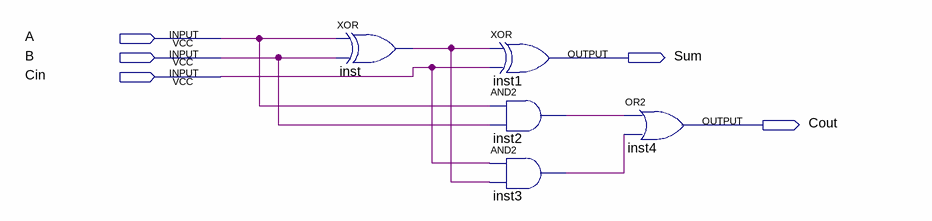
[diagram p0: schematic sheet]
// Quartus schematic FullAdder.bdf as structural Verilog: 5 symbols, 5 pins
module FullAdder (
  input  A,
  input  B,
  input  Cin,
  output Sum,
  output Cout
);

  wire inst2_out, inst3_out, inst_out;

  xor inst (inst_out, A, B);
  xor inst1 (Sum, inst_out, Cin);
  and inst2 (inst2_out, A, B);
  and inst3 (inst3_out, Cin, inst_out);
  or inst4 (Cout, inst2_out, inst3_out);
endmodule
